# EAGLE design SuperFeed (EAGLE 6.6.0)
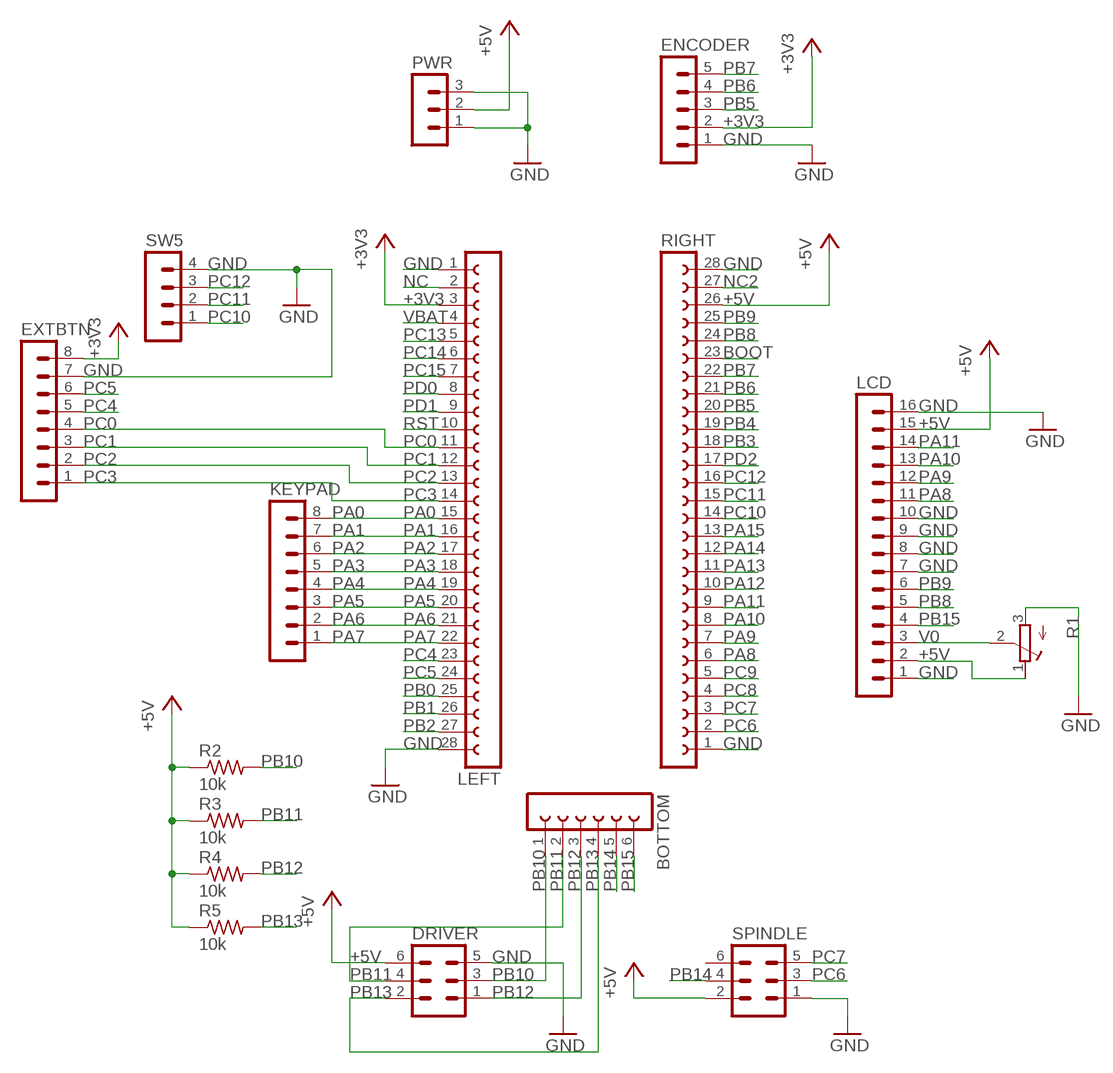
[diagram p0: schematic, sheet 1]

## Parts
BOTTOM  FE06-1  [FE06]
DRIVER  MA03-2W  [MA03-2W]
ENCODER  MA05-1W  [MA05-1W]
EXTBTN  MA08-1W  [MA08-1W]
KEYPAD  MA08-1W  [MA08-1W]
LCD  MA16-1  [MA16-1]
LEFT  FE28-1  [FE28]
PWR  MA03-1W  [MA03-1W]
R1  R-TRIMMT93YA  [RTRIMT93YA]
R2  10k  R-US_0207/10  [0207/10]
R3  10k  R-US_0207/10  [0207/10]
R4  10k  R-US_0207/10  [0207/10]
R5  10k  R-US_0207/10  [0207/10]
RIGHT  FE28-1  [FE28]
SPINDLE  MA03-2W  [MA03-2W]
SW5  MA04-1W  [MA04-1W]

## Nets
+3V3: ENCODER.2 EXTBTN.8 LEFT.3
+5V: DRIVER.6 LCD.2 LCD.15 PWR.2 R1.1(E) R2.1 R3.1 R4.1 R5.1 RIGHT.26 SPINDLE.2
BOOT: RIGHT.23
GND: DRIVER.5 ENCODER.1 EXTBTN.7 LCD.1 LCD.7 LCD.8 LCD.9 LCD.10 LCD.16 LEFT.1 LEFT.28 PWR.1 PWR.3 R1.3(A) RIGHT.1 RIGHT.28 SPINDLE.1 SW5.4
NC: LEFT.2
NC2: RIGHT.27
PA0: KEYPAD.8 LEFT.15
PA1: KEYPAD.7 LEFT.16
PA2: KEYPAD.6 LEFT.17
PA3: KEYPAD.5 LEFT.18
PA4: KEYPAD.4 LEFT.19
PA5: KEYPAD.3 LEFT.20
PA6: KEYPAD.2 LEFT.21
PA7: KEYPAD.1 LEFT.22
PA8: LCD.11 RIGHT.6
PA9: LCD.12 RIGHT.7
PA10: LCD.13 RIGHT.8
PA11: LCD.14 RIGHT.9
PA12: RIGHT.10
PA13: RIGHT.11
PA14: RIGHT.12
PA15: RIGHT.13
PB0: LEFT.25
PB1: LEFT.26
PB2: LEFT.27
PB3: RIGHT.18
PB4: RIGHT.19
PB5: ENCODER.3 RIGHT.20
PB6: ENCODER.4 RIGHT.21
PB7: ENCODER.5 RIGHT.22
PB8: LCD.5 RIGHT.24
PB9: LCD.6 RIGHT.25
PB10: BOTTOM.1 DRIVER.3 R2.2
PB11: BOTTOM.2 DRIVER.4 R3.2
PB12: BOTTOM.3 DRIVER.1 R4.2
PB13: BOTTOM.4 DRIVER.2 R5.2
PB14: BOTTOM.5 SPINDLE.4
PB15: BOTTOM.6 LCD.4
PC0: EXTBTN.4 LEFT.11
PC1: EXTBTN.3 LEFT.12
PC2: EXTBTN.2 LEFT.13
PC3: EXTBTN.1 LEFT.14
PC4: EXTBTN.5 LEFT.23
PC5: EXTBTN.6 LEFT.24
PC6: RIGHT.2 SPINDLE.3
PC7: RIGHT.3 SPINDLE.5
PC8: RIGHT.4
PC9: RIGHT.5
PC10: RIGHT.14 SW5.1
PC11: RIGHT.15 SW5.2
PC12: RIGHT.16 SW5.3
PC13: LEFT.5
PC14: LEFT.6
PC15: LEFT.7
PD0: LEFT.8
PD1: LEFT.9
PD2: RIGHT.17
RST: LEFT.10
V0: LCD.3 R1.2(S)
VBAT: LEFT.4
Unconnected: SPINDLE.6

## Library data of the parts
BOTTOM = SuperFeed:FE06-1: FEMALE HEADER; OC_FARNELL: unknown; OC_NEWARK: unknown
DRIVER SPINDLE = SuperFeed:MA03-2W: PIN HEADER
ENCODER = SuperFeed:MA05-1W: PIN HEADER
EXTBTN KEYPAD = SuperFeed:MA08-1W: PIN HEADER
LCD = SuperFeed:MA16-1: PIN HEADER
LEFT RIGHT = SuperFeed:FE28-1: FEMALE HEADER; OC_NEWARK: unknown
PWR = SuperFeed:MA03-1W: PIN HEADER
R1 = SuperFeed:R-TRIMM: Trimm resistor
R2-R5 = SuperFeed:R-US_: RESISTOR, American symbol
SW5 = SuperFeed:MA04-1W: PIN HEADER

## Board
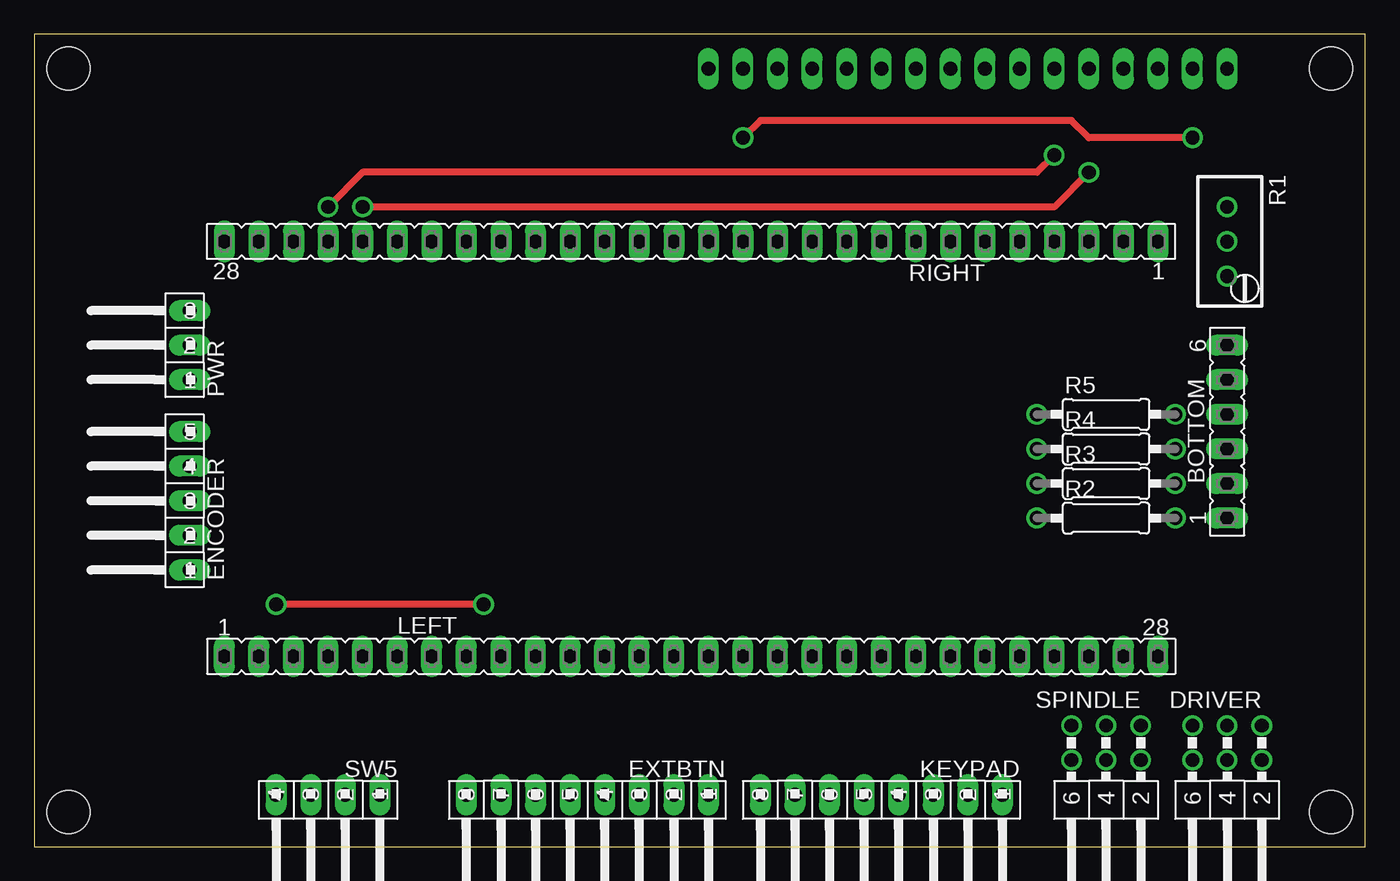
[diagram p1: board, top side]
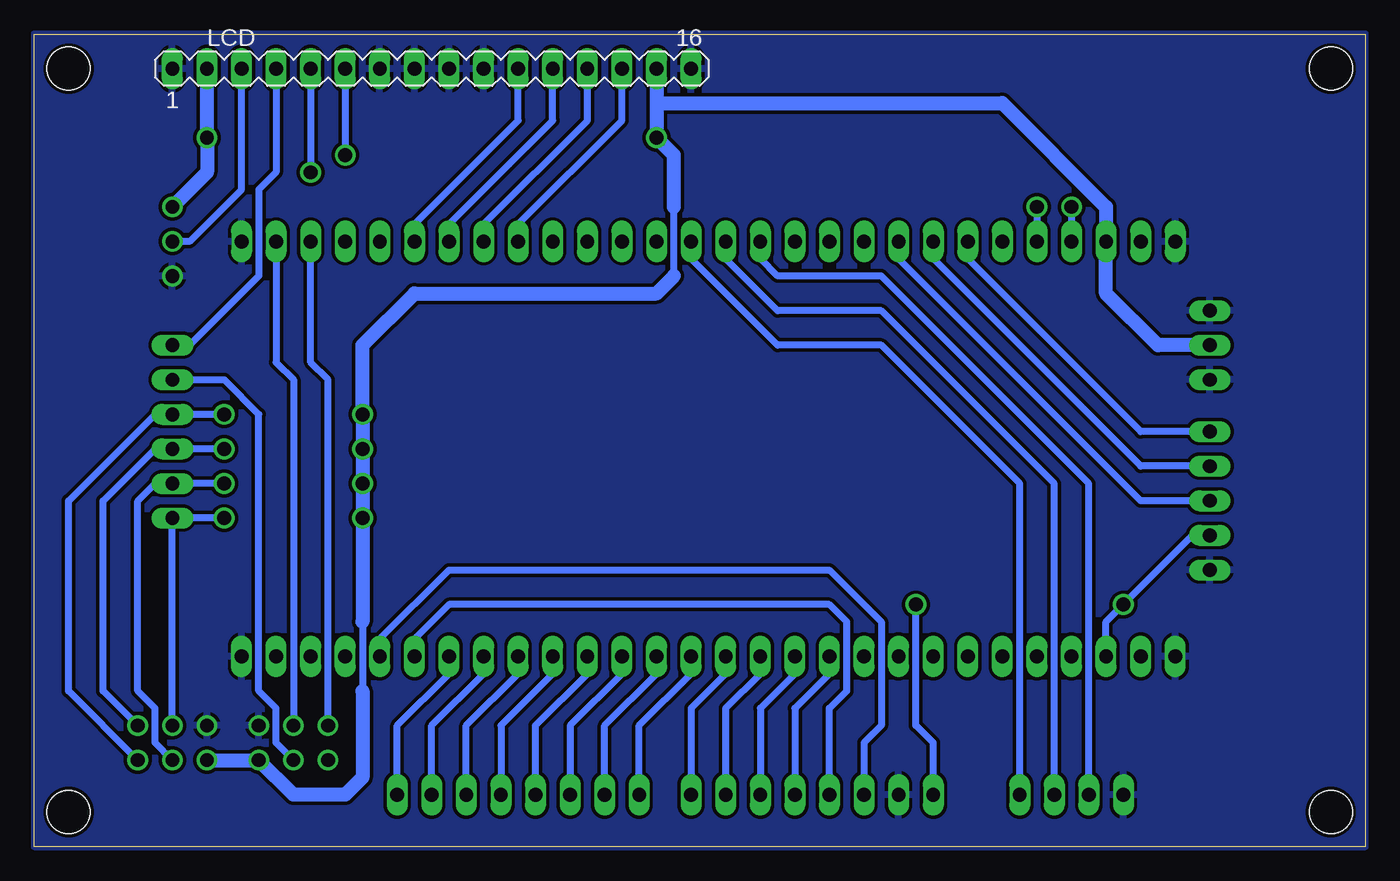
[diagram p2: board, bottom side, seen from below]

Size 97.79 x 59.69 mm. Coordinates in mm from the lower left corner, seen from the top.
Outline: 97.79,0 97.79,59.69 0,59.69 0,0 97.79,0
Copper layers (1*16): Top 0.035mm / dielectric 1.5mm / Bottom 0.035mm
Design rules "SuperFeed *": minimum track width 16mil, minimum drill 24mil, track to track 10mil, track to pad 10mil, pad to pad 10mil, via to via 10mil, smd to smd 10mil, copper to edge 0mil, drill to drill 10mil, minimum pad ring 10mil, minimum via ring 8mil, stop-mask expansion 4mil, vias tented up to drill 0mil, thermal gap 10mil
Holes 3.17 mm at 95.25,57.15 95.25,2.54 2.54,2.54 2.54,57.15

### Footprints (pad centres in the part's own frame; a part is rotated, then mirrored left to right if it is on the bottom)
FE06 = drill 1.016 long: 1 -6.35,0; 2 -3.81,0; 3 -1.27,0; 4 1.27,0; 5 3.81,0; 6 6.35,0
MA03-2W = drill 1.016: 1 -2.54,-1.27; 2 -2.54,1.27; 3 0,-1.27; 4 0,1.27; 5 2.54,-1.27; 6 2.54,1.27
MA05-1W = drill 1.016 long: 1 -5.08,0; 2 -2.54,0; 3 0,0; 4 2.54,0; 5 5.08,0
MA08-1W = drill 1.016 long: 1 -8.89,0; 2 -6.35,0; 3 -3.81,0; 4 -1.27,0; 5 1.27,0; 6 3.81,0; 7 6.35,0; 8 8.89,0
MA16-1 = drill 1.016 long: 1 -19.05,0; 2 -16.51,0; 3 -13.97,0; 4 -11.43,0; 5 -8.89,0; 6 -6.35,0; 7 -3.81,0; 8 -1.27,0; 9 1.27,0; 10 3.81,0; 11 6.35,0; 12 8.89,0; 13 11.43,0; 14 13.97,0; 15 16.51,0; 16 19.05,0
FE28 = drill 1.016 long: 1 -34.29,0; 2 -31.75,0; 3 -29.21,0; 4 -26.67,0; 5 -24.13,0; 6 -21.59,0; 7 -19.05,0; 8 -16.51,0; 9 -13.97,0; 10 -11.43,0; 11 -8.89,0; 12 -6.35,0; 13 -3.81,0; 14 -1.27,0; 15 1.27,0; 16 3.81,0; 17 6.35,0; 18 8.89,0; 19 11.43,0; 20 13.97,0; 21 16.51,0; 22 19.05,0; 23 21.59,0; 24 24.13,0; 25 26.67,0; 26 29.21,0; 27 31.75,0; 28 34.29,0
MA03-1W = drill 1.016 long: 1 -2.54,0; 2 0,0; 3 2.54,0
RTRIMT93YA = drill 1.016: 1 0,-2.54; 2 0,0; 3 0,2.54
0207/10 = drill 1.016: 1 -5.08,0; 2 5.08,0
MA04-1W = drill 1.016 long: 1 -3.81,0; 2 -1.27,0; 3 1.27,0; 4 3.81,0

### Placement (x,y rotation side)
BOTTOM  87.63,30.48 90 top
DRIVER  87.63,7.62 180 top
ENCODER  11.43,25.4 90 top
EXTBTN  40.64,3.81 180 top
KEYPAD  62.23,3.81 180 top
LCD  68.58,57.15 0 bottom
LEFT  48.26,13.97 0 top
PWR  11.43,36.83 90 top
R1  87.63,44.45 180 top
R2  78.74,24.13 0 top
R3  78.74,26.67 0 top
R4  78.74,29.21 0 top
R5  78.74,31.75 0 top
RIGHT  48.26,44.45 180 top
SPINDLE  78.74,7.62 180 top
SW5  21.59,3.81 180 top

### Tracks (layer width: path | path; a pad name or v marks a point on that pad's centre or on a via)
+3V3  (via drill 1.02)
  Top 0.508: v33.02,17.78 v17.78,17.78
  Bottom 0.508: LEFT.3 19.05,16.51 v17.78,17.78 12.7,22.86 ENCODER.2 | EXTBTN.8 31.75,7.62 33.02,8.89 v33.02,17.78
+5V  (via drill 1.02)
  Top 0.508: v85.09,52.07 77.47,52.07 76.2,53.34 53.34,53.34 v52.07,52.07
  Bottom 0.508: PWR.2 10.16,36.83 | 19.05,43.18 RIGHT.26 | 73.66,16.51 73.66,11.43 | 50.8,41.91 50.8,46.99
  Bottom 1.016: DRIVER.6 SPINDLE.2 78.74,3.81 74.93,3.81 73.66,5.08 73.66,11.43 | LCD.15 52.07,54.61 | 52.07,54.61 26.67,54.61 19.05,46.99 RIGHT.26 19.05,40.64 15.24,36.83 PWR.2 | 52.07,54.61 v52.07,52.07 50.8,50.8 50.8,46.99 | LCD.2 v85.09,52.07 85.09,49.53 R1.1 | 73.66,16.51 R2.1 R3.1 R4.1 R5.1 73.66,36.83 69.85,40.64 52.07,40.64 50.8,41.91
GND
  pour Bottom (isolate 0.254): 0,59.69 97.79,59.69 97.79,0 0,0
PA0
  Bottom 0.508: KEYPAD.8 53.34,8.89 49.53,12.7 LEFT.15
PA1
  Bottom 0.508: KEYPAD.7 55.88,8.89 52.07,12.7 LEFT.16
PA2
  Bottom 0.508: LEFT.17 54.61,12.7 58.42,8.89 KEYPAD.6
PA3
  Bottom 0.508: KEYPAD.5 60.96,8.89 57.15,12.7 LEFT.18
PA4
  Bottom 0.508: LEFT.19 59.69,12.7 63.5,8.89 KEYPAD.4
PA5
  Bottom 0.508: KEYPAD.3 66.04,8.89 62.23,12.7 LEFT.20
PA6
  Bottom 0.508: KEYPAD.2 68.58,8.89 64.77,12.7 LEFT.21
PA7
  Bottom 0.508: KEYPAD.1 71.12,8.89 67.31,12.7 LEFT.22
PA8
  Bottom 0.508: RIGHT.6 69.85,45.72 62.23,53.34 LCD.11
PA9
  Bottom 0.508: RIGHT.7 67.31,45.72 59.69,53.34 LCD.12
PA10
  Bottom 0.508: RIGHT.8 64.77,45.72 57.15,53.34 LCD.13
PA11
  Bottom 0.508: RIGHT.9 62.23,45.72 54.61,53.34 LCD.14
PB5
  Bottom 0.508: RIGHT.20 34.29,43.18 16.51,25.4 ENCODER.3
PB6
  Bottom 0.508: RIGHT.21 31.75,43.18 16.51,27.94 ENCODER.4
PB7
  Bottom 0.508: RIGHT.22 29.21,43.18 16.51,30.48 ENCODER.5
PB8  (via drill 1.02)
  Top 0.508: v77.47,49.53 74.93,46.99 v24.13,46.99
  Bottom 0.508: LCD.5 v77.47,49.53 | v24.13,46.99 RIGHT.24
PB9  (via drill 1.02)
  Top 0.508: v74.93,50.8 73.66,49.53 24.13,49.53 v21.59,46.99
  Bottom 0.508: LCD.6 v74.93,50.8 | v21.59,46.99 RIGHT.25
PB10
  Bottom 0.508: DRIVER.3 BOTTOM.1 R2.2
PB11
  Bottom 0.508: DRIVER.4 88.9,7.62 88.9,10.16 90.17,11.43 90.17,25.4 88.9,26.67 BOTTOM.2 R3.2
PB12
  Bottom 0.508: DRIVER.1 92.71,11.43 92.71,25.4 88.9,29.21 BOTTOM.3 R4.2
PB13
  Bottom 0.508: DRIVER.2 95.25,11.43 95.25,25.4 88.9,31.75 BOTTOM.4 R5.2
PB14
  Bottom 0.508: SPINDLE.4 80.01,7.62 80.01,10.16 81.28,11.43 81.28,31.75 83.82,34.29 BOTTOM.5
PB15
  Bottom 0.508: LCD.4 80.01,49.53 81.28,48.26 81.28,41.91 86.36,36.83 BOTTOM.6
PC0
  Bottom 0.508: LEFT.11 39.37,12.7 41.91,10.16 EXTBTN.4
PC1
  Bottom 0.508: LEFT.12 41.91,12.7 44.45,10.16 EXTBTN.3
PC2
  Bottom 0.508: LEFT.13 44.45,12.7 46.99,10.16 EXTBTN.2
PC3
  Bottom 0.508: LEFT.14 46.99,12.7 49.53,10.16 EXTBTN.1
PC4
  Bottom 0.508: EXTBTN.5 39.37,10.16 38.1,11.43 38.1,16.51 39.37,17.78 67.31,17.78 69.85,15.24 LEFT.23
PC5
  Bottom 0.508: LEFT.24 72.39,15.24 67.31,20.32 39.37,20.32 35.56,16.51 35.56,8.89 36.83,7.62 EXTBTN.6
PC6
  Bottom 0.508: RIGHT.2 80.01,35.56 78.74,34.29 SPINDLE.3
PC7
  Bottom 0.508: SPINDLE.5 76.2,34.29 77.47,35.56 RIGHT.3
PC10
  Bottom 0.508: SW5.1 25.4,26.67 35.56,36.83 43.18,36.83 49.53,43.18 RIGHT.14
PC11
  Bottom 0.508: SW5.2 22.86,26.67 35.56,39.37 43.18,39.37 46.99,43.18 RIGHT.15
PC12
  Bottom 0.508: SW5.3 20.32,26.67 35.56,41.91 43.18,41.91 44.45,43.18 RIGHT.16
V0
  Bottom 0.508: LCD.3 82.55,48.26 86.36,44.45 R1.2